# EAGLE schematic Light Sensos (EAGLE 8.7.0)
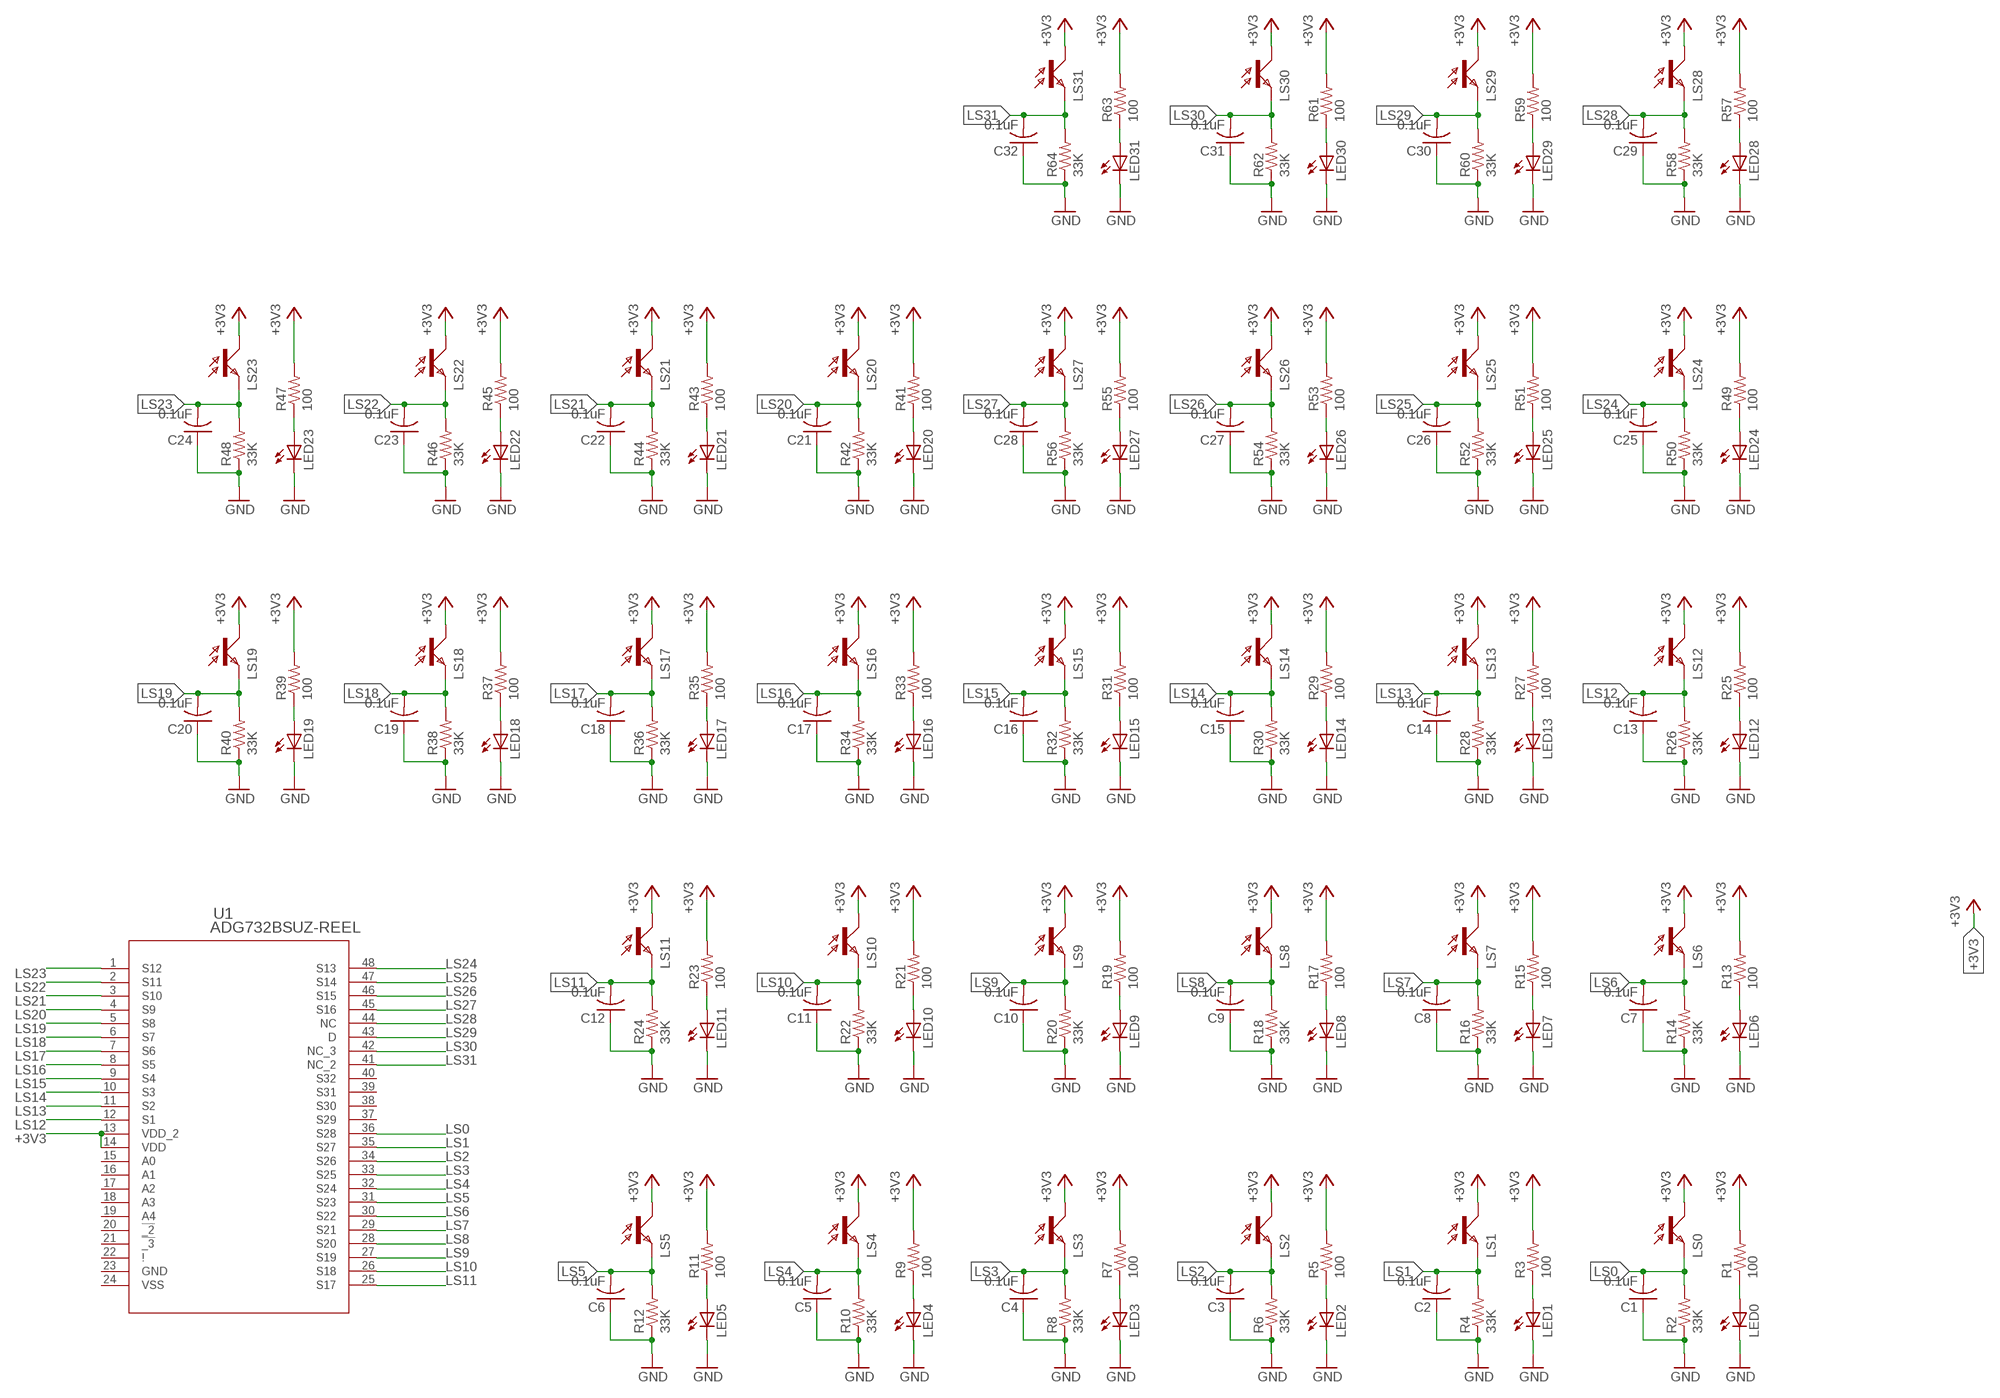
[diagram p0: schematic, sheet 1]

## Parts
C1  0.1uF  C-USC0603  [C0603]
C2  0.1uF  C-USC0603  [C0603]
C3  0.1uF  C-USC0603  [C0603]
C4  0.1uF  C-USC0603  [C0603]
C5  0.1uF  C-USC0603  [C0603]
C6  0.1uF  C-USC0603  [C0603]
C7  0.1uF  C-USC0603  [C0603]
C8  0.1uF  C-USC0603  [C0603]
C9  0.1uF  C-USC0603  [C0603]
C10  0.1uF  C-USC0603  [C0603]
C11  0.1uF  C-USC0603  [C0603]
C12  0.1uF  C-USC0603  [C0603]
C13  0.1uF  C-USC0603  [C0603]
C14  0.1uF  C-USC0603  [C0603]
C15  0.1uF  C-USC0603  [C0603]
C16  0.1uF  C-USC0603  [C0603]
C17  0.1uF  C-USC0603  [C0603]
C18  0.1uF  C-USC0603  [C0603]
C19  0.1uF  C-USC0603  [C0603]
C20  0.1uF  C-USC0603  [C0603]
C21  0.1uF  C-USC0603  [C0603]
C22  0.1uF  C-USC0603  [C0603]
C23  0.1uF  C-USC0603  [C0603]
C24  0.1uF  C-USC0603  [C0603]
C25  0.1uF  C-USC0603  [C0603]
C26  0.1uF  C-USC0603  [C0603]
C27  0.1uF  C-USC0603  [C0603]
C28  0.1uF  C-USC0603  [C0603]
C29  0.1uF  C-USC0603  [C0603]
C30  0.1uF  C-USC0603  [C0603]
C31  0.1uF  C-USC0603  [C0603]
C32  0.1uF  C-USC0603  [C0603]
LED0  LEDCHIPLED_0603  [CHIPLED_0603]
LED1  LEDCHIPLED_0603  [CHIPLED_0603]
LED2  LEDCHIPLED_0603  [CHIPLED_0603]
LED3  LEDCHIPLED_0603  [CHIPLED_0603]
LED4  LEDCHIPLED_0603  [CHIPLED_0603]
LED5  LEDCHIPLED_0603  [CHIPLED_0603]
LED6  LEDCHIPLED_0603  [CHIPLED_0603]
LED7  LEDCHIPLED_0603  [CHIPLED_0603]
LED8  LEDCHIPLED_0603  [CHIPLED_0603]
LED9  LEDCHIPLED_0603  [CHIPLED_0603]
LED10  LEDCHIPLED_0603  [CHIPLED_0603]
LED11  LEDCHIPLED_0603  [CHIPLED_0603]
LED12  LEDCHIPLED_0603  [CHIPLED_0603]
LED13  LEDCHIPLED_0603  [CHIPLED_0603]
LED14  LEDCHIPLED_0603  [CHIPLED_0603]
LED15  LEDCHIPLED_0603  [CHIPLED_0603]
LED16  LEDCHIPLED_0603  [CHIPLED_0603]
LED17  LEDCHIPLED_0603  [CHIPLED_0603]
LED18  LEDCHIPLED_0603  [CHIPLED_0603]
LED19  LEDCHIPLED_0603  [CHIPLED_0603]
LED20  LEDCHIPLED_0603  [CHIPLED_0603]
LED21  LEDCHIPLED_0603  [CHIPLED_0603]
LED22  LEDCHIPLED_0603  [CHIPLED_0603]
LED23  LEDCHIPLED_0603  [CHIPLED_0603]
LED24  LEDCHIPLED_0603  [CHIPLED_0603]
LED25  LEDCHIPLED_0603  [CHIPLED_0603]
LED26  LEDCHIPLED_0603  [CHIPLED_0603]
LED27  LEDCHIPLED_0603  [CHIPLED_0603]
LED28  LEDCHIPLED_0603  [CHIPLED_0603]
LED29  LEDCHIPLED_0603  [CHIPLED_0603]
LED30  LEDCHIPLED_0603  [CHIPLED_0603]
LED31  LEDCHIPLED_0603  [CHIPLED_0603]
LS0  ALS  [SMD]
LS1  ALS  [SMD]
LS2  ALS  [SMD]
LS3  ALS  [SMD]
LS4  ALS  [SMD]
LS5  ALS  [SMD]
LS6  ALS  [SMD]
LS7  ALS  [SMD]
LS8  ALS  [SMD]
LS9  ALS  [SMD]
LS10  ALS  [SMD]
LS11  ALS  [SMD]
LS12  ALS  [SMD]
LS13  ALS  [SMD]
LS14  ALS  [SMD]
LS15  ALS  [SMD]
LS16  ALS  [SMD]
LS17  ALS  [SMD]
LS18  ALS  [SMD]
LS19  ALS  [SMD]
LS20  ALS  [SMD]
LS21  ALS  [SMD]
LS22  ALS  [SMD]
LS23  ALS  [SMD]
LS24  ALS  [SMD]
LS25  ALS  [SMD]
LS26  ALS  [SMD]
LS27  ALS  [SMD]
LS28  ALS  [SMD]
LS29  ALS  [SMD]
LS30  ALS  [SMD]
LS31  ALS  [SMD]
R1  100  R-US_R0603  [R0603]
R2  33K  R-US_R0603  [R0603]
R3  100  R-US_R0603  [R0603]
R4  33K  R-US_R0603  [R0603]
R5  100  R-US_R0603  [R0603]
R6  33K  R-US_R0603  [R0603]
R7  100  R-US_R0603  [R0603]
R8  33K  R-US_R0603  [R0603]
R9  100  R-US_R0603  [R0603]
R10  33K  R-US_R0603  [R0603]
R11  100  R-US_R0603  [R0603]
R12  33K  R-US_R0603  [R0603]
R13  100  R-US_R0603  [R0603]
R14  33K  R-US_R0603  [R0603]
R15  100  R-US_R0603  [R0603]
R16  33K  R-US_R0603  [R0603]
R17  100  R-US_R0603  [R0603]
R18  33K  R-US_R0603  [R0603]
R19  100  R-US_R0603  [R0603]
R20  33K  R-US_R0603  [R0603]
R21  100  R-US_R0603  [R0603]
R22  33K  R-US_R0603  [R0603]
R23  100  R-US_R0603  [R0603]
R24  33K  R-US_R0603  [R0603]
R25  100  R-US_R0603  [R0603]
R26  33K  R-US_R0603  [R0603]
R27  100  R-US_R0603  [R0603]
R28  33K  R-US_R0603  [R0603]
R29  100  R-US_R0603  [R0603]
R30  33K  R-US_R0603  [R0603]
R31  100  R-US_R0603  [R0603]
R32  33K  R-US_R0603  [R0603]
R33  100  R-US_R0603  [R0603]
R34  33K  R-US_R0603  [R0603]
R35  100  R-US_R0603  [R0603]
R36  33K  R-US_R0603  [R0603]
R37  100  R-US_R0603  [R0603]
R38  33K  R-US_R0603  [R0603]
R39  100  R-US_R0603  [R0603]
R40  33K  R-US_R0603  [R0603]
R41  100  R-US_R0603  [R0603]
R42  33K  R-US_R0603  [R0603]
R43  100  R-US_R0603  [R0603]
R44  33K  R-US_R0603  [R0603]
R45  100  R-US_R0603  [R0603]
R46  33K  R-US_R0603  [R0603]
R47  100  R-US_R0603  [R0603]
R48  33K  R-US_R0603  [R0603]
R49  100  R-US_R0603  [R0603]
R50  33K  R-US_R0603  [R0603]
R51  100  R-US_R0603  [R0603]
R52  33K  R-US_R0603  [R0603]
R53  100  R-US_R0603  [R0603]
R54  33K  R-US_R0603  [R0603]
R55  100  R-US_R0603  [R0603]
R56  33K  R-US_R0603  [R0603]
R57  100  R-US_R0603  [R0603]
R58  33K  R-US_R0603  [R0603]
R59  100  R-US_R0603  [R0603]
R60  33K  R-US_R0603  [R0603]
R61  100  R-US_R0603  [R0603]
R62  33K  R-US_R0603  [R0603]
R63  100  R-US_R0603  [R0603]
R64  33K  R-US_R0603  [R0603]
U1  ADG732BSUZ-REEL  [SU_48]

## Nets
+3V3: LS0.C LS1.C LS2.C LS3.C LS4.C LS5.C LS6.C LS7.C LS8.C LS9.C LS10.C LS11.C LS12.C LS13.C LS14.C LS15.C LS16.C LS17.C LS18.C LS19.C LS20.C LS21.C LS22.C LS23.C LS24.C LS25.C LS26.C LS27.C LS28.C LS29.C LS30.C LS31.C R1.2 R3.2 R5.2 R7.2 R9.2 R11.2 R13.2 R15.2 R17.2 R19.2 R21.2 R23.2 R25.2 R27.2 R29.2 R31.2 R33.2 R35.2 R37.2 R39.2 R41.2 R43.2 R45.2 R47.2 R49.2 R51.2 R53.2 R55.2 R57.2 R59.2 R61.2 R63.2 U1.13(VDD_2) U1.14(VDD)
GND: C1.1 C2.1 C3.1 C4.1 C5.1 C6.1 C7.1 C8.1 C9.1 C10.1 C11.1 C12.1 C13.1 C14.1 C15.1 C16.1 C17.1 C18.1 C19.1 C20.1 C21.1 C22.1 C23.1 C24.1 C25.1 C26.1 C27.1 C28.1 C29.1 C30.1 C31.1 C32.1 LED0.C LED1.C LED2.C LED3.C LED4.C LED5.C LED6.C LED7.C LED8.C LED9.C LED10.C LED11.C LED12.C LED13.C LED14.C LED15.C LED16.C LED17.C LED18.C LED19.C LED20.C LED21.C LED22.C LED23.C LED24.C LED25.C LED26.C LED27.C LED28.C LED29.C LED30.C LED31.C R2.1 R4.1 R6.1 R8.1 R10.1 R12.1 R14.1 R16.1 R18.1 R20.1 R22.1 R24.1 R26.1 R28.1 R30.1 R32.1 R34.1 R36.1 R38.1 R40.1 R42.1 R44.1 R46.1 R48.1 R50.1 R52.1 R54.1 R56.1 R58.1 R60.1 R62.1 R64.1
LS0: C1.2 LS0.E R2.2 U1.36(S28)
LS1: C2.2 LS1.E R4.2 U1.35(S27)
LS2: C3.2 LS2.E R6.2 U1.34(S26)
LS3: C4.2 LS3.E R8.2 U1.33(S25)
LS4: C5.2 LS4.E R10.2 U1.32(S24)
LS5: C6.2 LS5.E R12.2 U1.31(S23)
LS6: C7.2 LS6.E R14.2 U1.30(S22)
LS7: C8.2 LS7.E R16.2 U1.29(S21)
LS8: C9.2 LS8.E R18.2 U1.28(S20)
LS9: C10.2 LS9.E R20.2 U1.27(S19)
LS10: C11.2 LS10.E R22.2 U1.26(S18)
LS11: C12.2 LS11.E R24.2 U1.25(S17)
LS12: C13.2 LS12.E R26.2 U1.12(S1)
LS13: C14.2 LS13.E R28.2 U1.11(S2)
LS14: C15.2 LS14.E R30.2 U1.10(S3)
LS15: C16.2 LS15.E R32.2 U1.9(S4)
LS16: C17.2 LS16.E R34.2 U1.8(S5)
LS17: C18.2 LS17.E R36.2 U1.7(S6)
LS18: C19.2 LS18.E R38.2 U1.6(S7)
LS19: C20.2 LS19.E R40.2 U1.5(S8)
LS20: C21.2 LS20.E R42.2 U1.4(S9)
LS21: C22.2 LS21.E R44.2 U1.3(S10)
LS22: C23.2 LS22.E R46.2 U1.2(S11)
LS23: C24.2 LS23.E R48.2 U1.1(S12)
LS24: C25.2 LS24.E R50.2 U1.48(S13)
LS25: C26.2 LS25.E R52.2 U1.47(S14)
LS26: C27.2 LS26.E R54.2 U1.46(S15)
LS27: C28.2 LS27.E R56.2 U1.45(S16)
LS28: C29.2 LS28.E R58.2 U1.44(NC)
LS29: C30.2 LS29.E R60.2 U1.43(D)
LS30: C31.2 LS30.E R62.2 U1.42(NC_3)
LS31: C32.2 LS31.E R64.2 U1.41(NC_2)
N$1: LED0.A R1.1
N$2: LED1.A R3.1
N$3: LED2.A R5.1
N$4: LED3.A R7.1
N$5: LED4.A R9.1
N$6: LED5.A R11.1
N$7: LED6.A R13.1
N$8: LED7.A R15.1
N$9: LED8.A R17.1
N$10: LED9.A R19.1
N$11: LED10.A R21.1
N$12: LED11.A R23.1
N$13: LED12.A R25.1
N$14: LED13.A R27.1
N$15: LED14.A R29.1
N$16: LED15.A R31.1
N$17: LED16.A R33.1
N$18: LED17.A R35.1
N$19: LED18.A R37.1
N$20: LED19.A R39.1
N$21: LED20.A R41.1
N$22: LED21.A R43.1
N$23: LED22.A R45.1
N$24: LED23.A R47.1
N$25: LED24.A R49.1
N$26: LED25.A R51.1
N$27: LED26.A R53.1
N$28: LED27.A R55.1
N$29: LED28.A R57.1
N$30: LED29.A R59.1
N$31: LED30.A R61.1
N$32: LED31.A R63.1
Unconnected: U1.15(A0) U1.16(A1) U1.17(A2) U1.18(A3) U1.19(A4) U1.20(!_2) U1.21(!_3) U1.22(!) U1.23(GND) U1.37(S29) U1.38(S30) U1.39(S31) U1.40(S32)

## Power pins joined to a net without a drawn wire
VSS: U1.24(VSS)

## Library data of the parts
C1-C32 = adafruit:C-US: CAPACITOR, American symbol
LED0 LED1-LED31 = adafruit:LED: LED OSRAM: - CHIPLED LG R971, LG N971, LY N971, LG Q971, LY Q971, LO R971, LY R971 LH N974, LH R974 LS Q976, LO Q976, LY Q976 LO Q996 - Hyper CHIPLED LW Q18S LB Q993, LB Q99A, LB R99A - SideLED LS A670, LO A670, LY A670, LG A670, LP A670 LB A673, LV A673, LT A673, LW A673 LH A674 LY A675 LS A676, LA A676, LO A676, LY A676, LW A676 LS A679, LY A679, LG A679 - Hyper Micro SIDELED® LS Y876, LA Y876, LO Y876, LY Y876 LT Y87S - SmartLED LW L88C, LW L88S LB L89C, LB L89S, LG L890 LS L89K, LO L89K, LY L89K LS L896, LA L896, LO L896, LY L896 - TOPLED LS T670, LO T670, LY T670, LG T670, LP T670 LSG T670, LSP T670, LSY T670, LOP T670, LYG T670 LG T671, LOG T671, LSG T671 LB T673, LV T673, LT T673, LW T673 LH T674 LS T676, LA T676, LO T676, LY T676, LB T676, LH T676, LSB T676, LW T676 LB T67C, LV T67C, LT T67C, LS T67K, LO T67K, LY T67K, LW E67C LS E67B, LA E67B, LO E67B, LY E67B, LB E67C, LV E67C, LT E67C LW T67C LS T679, LY T679, LG T679 LS T770, LO T770, LY T770, LG T770, LP T770 LB T773, LV T773, LT T773, LW T773 LH T774 LS E675, LA E675, LY E675, LS T675 LS T776, LA T776, LO T776, LY T776, LB T776 LHGB T686 LT T68C, LB T68C - Hyper Mini TOPLED® LB M676 - Mini TOPLED Santana® LG M470 LS M47K, LO M47K, LY M47K Source: http://www.osram.convergy.de/
LS0 LS1-LS31 = phototransitor-ALS-PT19-315CL177TR8:ALS
R1-R64 = adafruit:R-US_: RESISTOR, American symbol
U1 = ADG732:ADG732BSUZ-REEL; MANUFACTURER_PART_NUMBER: ADG732BSUZREEL; VENDOR: Analog Devices Inc